# Altium schematic sheet RS232_RS485_INTERFACE.SchDoc
size A4; SheetNumber: 18; SheetTotal: 27
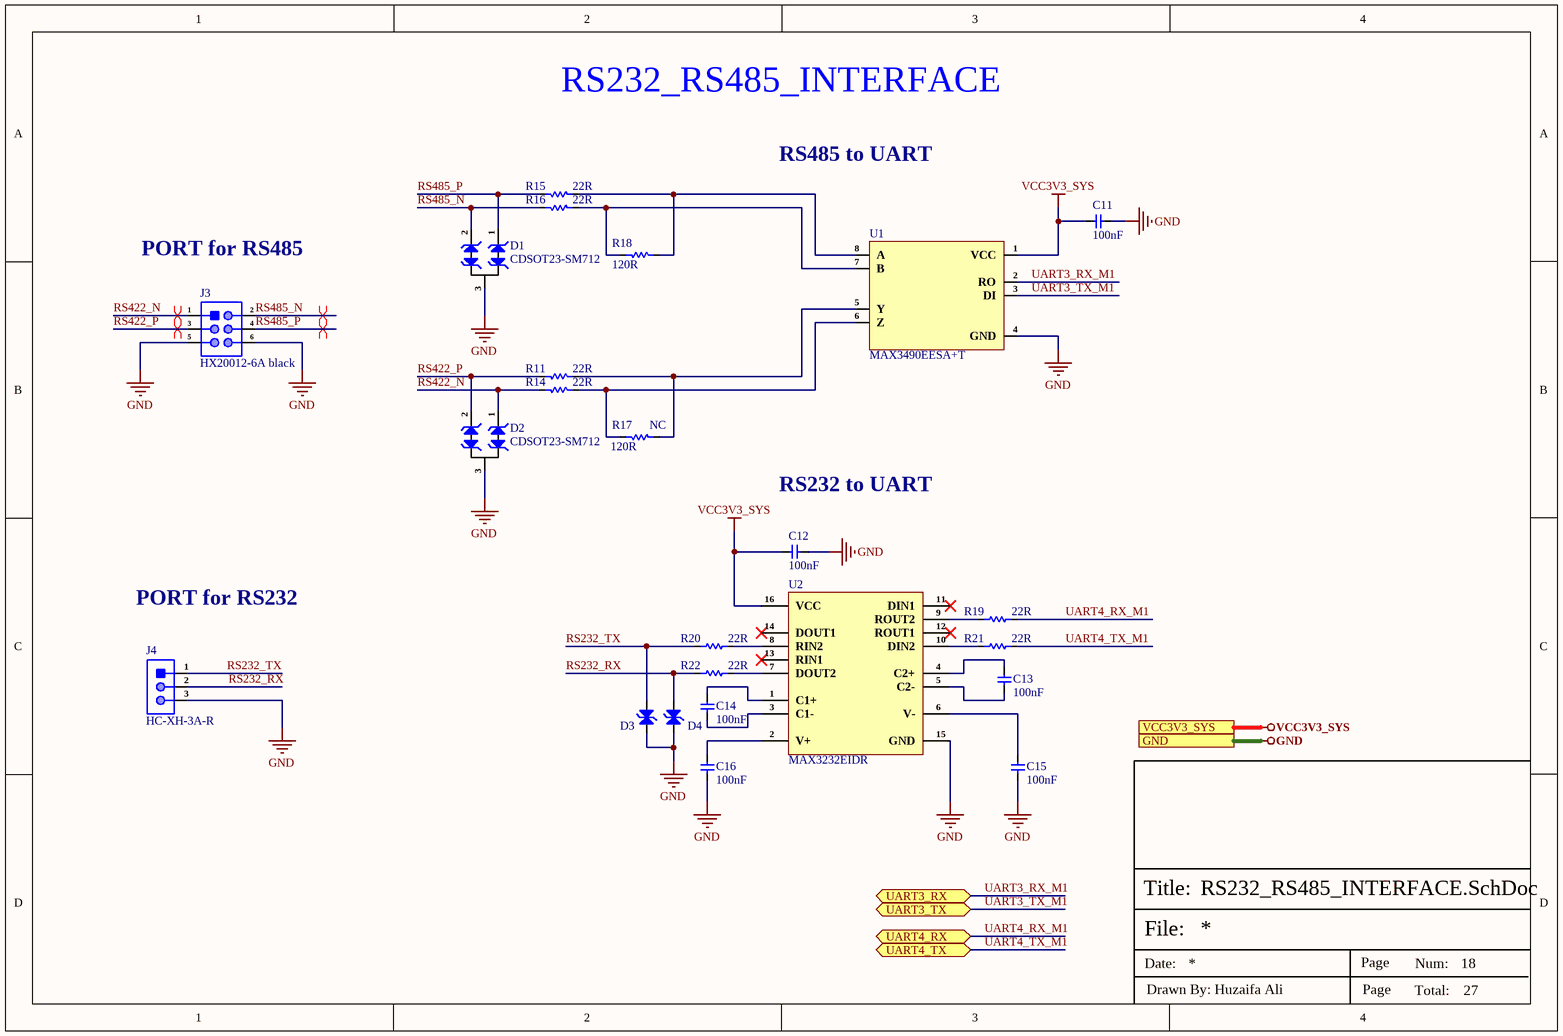
[diagram p0: RS232_RS485_INTERFACE.SchDoc]

## Parts
C11  100nF  [Cap-0402]
C12  100nF  [Cap-0402]
C13  100nF  [Cap-0402]
C14  100nF  [Cap-0402]
C15  100nF  [Cap-0402]
C16  100nF  [Cap-0402]
D1  CDSOT23-SM712  [SOT-23]
D2  CDSOT23-SM712  [SOT-23]
D3  ESD5451N  [DFN1006-2L (Bi-Directional)]  (value not drawn)
D4  ESD5451N  [DFN1006-2L (Bi-Directional)]  (value not drawn)
J3  HX20012-6A black  [HX20012-6A black]
J4  HC-XH-3A-R  [HC-XH-3A-R]
R11  22R  [Res-0402]
R14  22R  [Res-0402]
R15  22R  [Res-0402]
R16  22R  [Res-0402]
R17  NC  [Res-0603]
R18  120R  [Res-0603]
R19  22R  [Res-0402]
R20  22R  [Res-0402]
R21  22R  [Res-0402]
R22  22R  [Res-0402]
U1  MAX3490EESA+T  [SOIC-8(0.154", 3.90mm Width)]
U2  MAX3232EIDR  [SOIC-16]

## Ports
GND (see TOP SHEET[1D], AUDIO_INTERFACE[1D], BUCK REGULATOR[3D], DEBUG_UART_INTERFACE[3D], DIGITAL IO_RELAY_SHEET[5D], DUAL_SIM_INTERFACE[3D], ETHERNET_PHY0[4D], ETHERNET_PHY1[4D], GSM_INTERFACE[2D], HDMI_INTERFACE[3D], INPUT_PROTECTION[3D], LINEAR_VOLTAGE_REG[3D], MICRO_SD_INTERFACE[3D], MIPI-DSI DISPLAY[3D], POWER SECTION[3D], PUSH BUTTONs_INTERFACE[3C], RGB_LEDs_INTERFACE[3D], ROCKCHIP_PWR_SUPPLY[1D], ROCKCHIP_SYSTEM_CONTROL[3C], SENSOR_SHEET[3D], USB2.0_INTERFACE[3D], USB3.0_INTERFACE[3D], USB-C_INTERFACE[2D], WIEGAND_INTERFACE[3D], WIFI_BLUETOOTH_SHEET[4C]), UART3_RX (bidir, see TOP SHEET[2D], DEBUG_UART_INTERFACE[3D]), UART3_TX (bidir, see TOP SHEET[2D], DEBUG_UART_INTERFACE[3D]), UART4_RX (bidir, see TOP SHEET[2D], DEBUG_UART_INTERFACE[3D]), UART4_TX (bidir, see TOP SHEET[2D], DEBUG_UART_INTERFACE[3D]), VCC3V3_SYS (see TOP SHEET[1D], AUDIO_INTERFACE[1D], BUCK REGULATOR[3D], DEBUG_UART_INTERFACE[3D], DIGITAL IO_RELAY_SHEET[5D], ETHERNET_PHY0[4D], ETHERNET_PHY1[4D], GSM_INTERFACE[2D], HDMI_INTERFACE[3D], LINEAR_VOLTAGE_REG[3D], MIPI-DSI DISPLAY[3D], POWER SECTION[3D], PUSH BUTTONs_INTERFACE[3C], ROCKCHIP_PWR_SUPPLY[1D], ROCKCHIP_SYSTEM_CONTROL[3C], SENSOR_SHEET[3D], USB-C_INTERFACE[2D], WIEGAND_INTERFACE[3D], WIFI_BLUETOOTH_SHEET[4C])

## Nets
GND: C11.2 C12.2 C15.2 C16.2 D1.3(GND) D2.3(GND) D3.1(K) D4.1(K) J3.5 J3.6 J4.3 U1.4(GND) U2.15(GND) ; port GND
VCC3V3_SYS: C11.1 C12.1 U1.1(VCC) U2.16(VCC) ; port VCC3V3_SYS
RS232_RX: D4.2(K) J4.2 R22.1
RS232_TX: D3.2(K) J4.1 R20.1
RS422_N: D2.1(IO1) J3.1 R14.2
RS422_P: D2.2(IO2) J3.3 R11.2
RS485_N: D1.2(IO2) J3.2 R16.2
RS485_P: D1.1(IO1) J3.4 R15.2
UART3_RX_M1: U1.2(RO) ; port UART3_RX
UART3_TX_M1: U1.3(DI) ; port UART3_TX
UART4_RX_M1: R19.2 ; port UART4_RX
UART4_TX_M1: R21.2 ; port UART4_TX
NetC13_1: C13.1 U2.4(C2+)
NetC13_2: C13.2 U2.5(C2-)
NetC14_1: C14.1 U2.1(C1+)
NetC14_2: C14.2 U2.3(C1-)
NetC15_1: C15.1 U2.6(V-)
NetC16_1: C16.1 U2.2(V+)
NetR11_1: R11.1 R17.1 U1.5(Y)
NetR14_1: R14.1 R17.2 U1.6(Z)
NetR15_1: R15.1 R18.1 U1.8(A)
NetR16_1: R16.1 R18.2 U1.7(B)
NetR19_1: R19.1 U2.9(ROUT2)
NetR20_2: R20.2 U2.8(RIN2)
NetR21_1: R21.1 U2.10(DIN2)
NetR22_2: R22.2 U2.7(DOUT2)

Not connected (* = marked no-connect by the designer): U2 11(DIN1)* 12(ROUT1)* 13(RIN1)* 14(DOUT1)*

## Layout directives
differential pair; net class RS485; differential pair class DIFF_RS485_120; rule Impedance Constraint [Min = 115.0    Max = 120.0    ]; rule Matched Net Lengths [Tolerance = 0.508mm]: RS422_N, RS422_P, RS485_N, RS485_P

## Notes on the sheet
- RS232_RS485_INTERFACE
- RS485 to UART
- PORT for RS485
- (near R17) 120R
- RS232 to UART
- PORT for RS232
- File:
- Title:
- Date:
- Page
- Num:
- Total:
- Drawn By: Huzaifa Ali

## Library data of the parts
C11-C16 = CC0402KRX5R7BB104: CAP CER 0.1UF 16V X5R 0402; Manufacturer: Yageo; Tolerance: 10%; Supplier 1: Mouser; Manufacturer Part Number: CC0402KRX5R7BB104; RoHS: Yes; Category: Ceramic Capacitors; Stock 1: 936792; Pricing 1: 1=0.10000, 10=0.02300, 50=0.02300, 100=0.01100, 1000=0.00600, 10000=0.00400 (USD); Mount: Surface Mount; Case/Package: 0402; Case Code (Metric): 1005; Case Code (Imperial): 0402; Min Operating Temperature: -55°C; Max Operating Temperature: 85°C; Capacitance: 100nF; Packaging: Tape and Reel; Voltage Rating: 16V; Dielectric: X5R; Termination: SMD/SMT; Voltage Rating (DC): 16V; Package Quantity: 1; Series: CC; Length: 1mm; Width: 0.02inch; Height: 0.5mm; Thickness: 0.022inch; Lead Free: Lead Free; RoHS Compliant: Yes; ComponentLink1URL: https://datasheet.ciiva.com/155/mlccorderingcode-155879.pdf?src-supplier=Digi-Key; ComponentLink1Description: https://datasheet.ciiva.com/155/mlccorderingcode-155879.pdf?src-supplier=Digi-Key; ComponentLink2URL: https://datasheet.ciiva.com/155/mlccorderingcode-155878.pdf?src-supplier=Digi-Key; ComponentLink2Description: https://datasheet.ciiva.com/155/mlccorderingcode-155878.pdf?src-supplier=Digi-Key; ComponentLink3URL: https://datasheet.ciiva.com/155/mlccorderingcode-155880.pdf?src-supplier=Digi-Key; ComponentLink3Description: https://datasheet.ciiva.com/155/mlccorderingcode-155880.pdf?src-supplier=Digi-Key; ComponentLink4URL: https://datasheet.ciiva.com/11464/upy-gphc-x5r-4v-to-50v-12-11464869.pdf?src-supplier=Avnet; ComponentLink4Description: https://datasheet.ciiva.com/11464/upy-gphc-x5r-4v-to-50v-12-11464869.pdf?src-supplier=Avnet; Supplier Part Number 1: 603-CC402KRX5R7BB104; LCSC Part Number: C106204; Number of Pins: 2; Resistor Type: Ceramic; Construction: Flat; Depth: 0.5mm; Radiation Hardening: No; REACH SVHC: Unknown; Halogen Free: Halogen Free
D1 D2 = CDSOT23-SM712: TVS DIODE 7V/12V 14V/26V SOT23-3; Manufacturer: Bourns; Direction: Bidirectional; Value: 75pF; Max Surge Current: 30A; Polarity: Bidirectional,Unidirectional; Number of Channels: 2; Breakdown Voltage: 13.3V; Clamping Voltage: 19V; Working Voltage: 12V; Min Breakdown Voltage: 7.5V; Power Line Protection: No; Leakage Current: 20uA; Peak Pulse Current: 17A; Diode Type: ZENER; Max Power Dissipation: 600W; Peak Pulse Power: 400W; ESD Protection: Yes; Test Current: 1mA; Item Type: Surge Protection (TVS/ESD); Supplier: Rs; Supplier Part Number: 7673728P; Manufacturer Part Number: CDSOT23-SM712; RoHS: Yes; Category: TVS Diodes; Stock: 89660; Pricing: 100=0.935, 1500=0.651, 3000=0.565, 6000=0.553 (GBP); Mounting Technology: Surface Mount; Case/Package: SOT-23; Pins: 3; Contact Plating: Tin; Min Operating Temperature: -55°C; Max Operating Temperature: 150°C; Packaging: Tape and Reel; Series: -; Termination: SMD/SMT; Reverse Standoff Voltage: 12V; Number of Elements: 2; Reverse Breakdown Voltage: 13.3V; Number of Bidirectional Channels: 2; Power Dissipation: 400W; Max Reverse Leakage Current: 20uA; Max Breakdown Voltage: 13.3V; Length: 3.04mm; Width: 0.055inch; Height: 1.11mm; Depth: 1.4mm; Radiation Hardening: No; Reach SVHC Compliant: No; RoHS Compliant: Yes; ComponentLink1URL: https://datasheet.ciiva.com/1281/1670933-1281331.pdf?src-supplier=Farnell; ComponentLink1Description: https://datasheet.ciiva.com/1281/1670933-1281331.pdf?src-supplier=Farnell; ComponentLink2URL: https://datasheet.ciiva.com/4510/cdsot23-sm712-25932-4510261.pdf?src-supplier=Mouser; ComponentLink2Description: https://datasheet.ciiva.com/4510/cdsot23-sm712-25932-4510261.pdf?src-supplier=Mouser; ComponentLink3URL: https://datasheet.ciiva.com/11193/cdsot23-sm712-11193846.pdf?src-supplier=Avnet; ComponentLink3Description: https://datasheet.ciiva.com/11193/cdsot23-sm712-11193846.pdf?src-supplier=Avnet; ComponentLink4URL: https://datasheet.ciiva.com/22696/1670933-22696779.pdf?src-supplier=Element14; ComponentLink4Description: https://datasheet.ciiva.com/22696/1670933-22696779.pdf?src-supplier=Element14; ComponentLink5URL: https://datasheet.ciiva.com/26828/getdatasheetpartid-418501-26828522.pdf?src-supplier=Verical; ComponentLink5Description: https://datasheet.ciiva.com/26828/getdatasheetpartid-418501-26828522.pdf?src-supplier=Verical; ComponentLink6URL: https://datasheet.ciiva.com/337/cdsot23-sm712-337451.pdf?src-supplier=Digikey; ComponentLink6Description: https://datasheet.ciiva.com/337/cdsot23-sm712-337451.pdf?src-supplier=Digikey; ComponentLink7URL: https://datasheet.ciiva.com/337/cdsot23-sm712-337452.pdf?src-supplier=Digikey; ComponentLink7Description: https://datasheet.ciiva.com/337/cdsot23-sm712-337452.pdf?src-supplier=Digikey; LCSC Part Number: C404012
D3 D4 = ESD5451N: DFN1006-2(0402) ESD Protection Devices ROHS; Manufacturer: TECH PUBLIC; Manufacturer Part Number: ESD5451N; Footprint: DFN1006-2(0402); ComponentLink1Description: LCSC; ComponentLink1URL: https://www.lcsc.com/product-detail/span-style-background-color-ff0-ESD-span-Protection-Devices_TECH-PUBLIC-ESD5451N_C2936977.html; LCSC Part Number: C2936977
J3 = HX20012-6A black: 2x3P 2 2mm 2mm male 3 -25℃~+85℃ 3A Straight Plugin,P=2mm Wire To Board / Wire To Wire Connector ROHS; Manufacturer: HX(Zhejiang Yueqing Hongxing Elec); Manufacturer Part Number: HX20012-6A black; Package: Plugin,P=2mm; LCSC Part Number: C469723; Item Type: Wire To Wire Connector; ComponentLink1Description: LCSC; ComponentLink1URL: https://jlcpcb.com/partdetail/475972-HX20012_6Ablack/C469723
J4 = HC-XH-3A-R: 1x3P 3P XH 1 Tin 2.5mm 3 -25℃~+85℃ Brass 3A Straight Plugin,P=2.5mm Wire To Board Connector ROHS; Manufacturer: HCTL; Manufacturer Part Number: HC-XH-3A-R; Package: Plugin,P=2.5mm; LCSC Part Number: C7466690; Item Type: Wire To Board Connector; ComponentLink1Description: LCSC; ComponentLink1URL: https://www.lcsc.com/product-detail/Wire-To-Board-Connector_HCTL-HC-XH-3A-R_C7466690.html
R11 R14-R16 R19-R22 = RC0402FR-0722RL: RES 22 OHM 1% 1/16W 0402; Manufacturer: Yageo; Max Power Dissipation: 63mW; Temperature Coefficient: 100ppm/°C; Voltage Rating: 50V; Power Rating: 62.5mW; Item Type: Resistor; Supplier 1: Avnet; Manufacturer Part Number: RC0402FR-0722RL; Stock 1: 1810000; Pricing 1: 10000=0.00085 (USD); Case/Package: 0402; Case Code (Metric): 1005; Case Code (Imperial): 0402; Min Operating Temperature: -55°C; Max Operating Temperature: 155°C; Packaging: Tape and Reel; Resistance: 22R; Resistor Type: Thick Film; Number of Terminations: 2; Tolerance: 1%; Features: Moisture Resistant; Length: 1mm; Width: 0.5mm; Height: 0.32mm; RoHS Compliant: Yes; ComponentLink1URL: https://datasheet.ciiva.com/11819/0900766b80c66297-11819462.pdf?src-supplier=RSComponents; ComponentLink1Description: https://datasheet.ciiva.com/11819/0900766b80c66297-11819462.pdf?src-supplier=RSComponents; Supplier Part Number 1: RC0402FR-0722RL; LCSC Part Number: C114765; RoHS: Yes; Category: Chip SMD Resistors; Number of Pins: 2; Size Code: 0402; Voltage Rating (DC): 50V; Termination: SMD/SMT; Series: RC; Resistance Tolerance: 1%; Technology: THICK FILM; Construction: Rectangular; Depth: 0.5mm; Reach SVHC Compliant: Yes; Military Standard: Not; Lead Free: Lead Free; ComponentLink2URL: https://datasheet.ciiva.com/7849/1018594-7849912.pdf?src-supplier=Element14; ComponentLink2Description: https://datasheet.ciiva.com/7849/1018594-7849912.pdf?src-supplier=Element14; ComponentLink3URL: https://datasheet.ciiva.com/7849/1018594-7849911.pdf?src-supplier=Element14; ComponentLink3Description: https://datasheet.ciiva.com/7849/1018594-7849911.pdf?src-supplier=Element14; ComponentLink4URL: https://datasheet.ciiva.com/16930/pyu-rc0402-51-rohs-l-6-r-16930687.pdf?src-supplier=Future+Electronics; ComponentLink4Description: https://datasheet.ciiva.com/16930/pyu-rc0402-51-rohs-l-6-r-16930687.pdf?src-supplier=Future+Electronics; ComponentLink5URL: https://datasheet.ciiva.com/26829/getdatasheetpartid-554995-26829991.pdf?src-supplier=Verical; ComponentLink5Description: https://datasheet.ciiva.com/26829/getdatasheetpartid-554995-26829991.pdf?src-supplier=Verical
R17 = RT0603BRB07120RL: RES SMD 120 OHM 0.1% 1/10W 0603; Manufacturer: Yageo; Temperature Coefficient: 10ppm/°C; Voltage Rating: 75V; Max Power Dissipation: 100mW; Value: 120R; Item Type: Resistor; Manufacturer Part Number: RT0603BRB07120RL; RoHS: Yes; Category: Chip SMD Resistors; Case/Package: 0603; Min Operating Temperature: -55°C; Max Operating Temperature: 155°C; Tolerance: 0.1%; Packaging: Tape and Reel; Number of Terminations: 2; Features: Moisture Resistant; Series: RT; Length: 0.063inch; Width: 0.031inch; Height: 0.022inch; RoHS Compliant: Yes; ComponentLink1URL: http://www.yageo.com/documents/recent/PYu-RT_1-to-0.01_RoHS_L_8.pdf?src-supplier=Digikey; ComponentLink1Description: http://www.yageo.com/documents/recent/PYu-RT_1-to-0.01_RoHS_L_8.pdf?src-supplier=Digikey; LCSC Part Number: C860088; Supplier: Digikey; Supplier Part Number: RT0603BRB07120RL-ND; Pricing: 5000=0.13797 (USD)
R18 = RT0603BRB07120RL: RES SMD 120 OHM 0.1% 1/10W 0603; Manufacturer: Yageo; Temperature Coefficient: 10ppm/°C; Voltage Rating: 75V; Max Power Dissipation: 100mW; Item Type: Resistor; Manufacturer Part Number: RT0603BRB07120RL; RoHS: Yes; Category: Chip SMD Resistors; Case/Package: 0603; Min Operating Temperature: -55°C; Max Operating Temperature: 155°C; Tolerance: 0.1%; Packaging: Tape and Reel; Number of Terminations: 2; Features: Moisture Resistant; Series: RT; Length: 0.063inch; Width: 0.031inch; Height: 0.022inch; RoHS Compliant: Yes; ComponentLink1URL: http://www.yageo.com/documents/recent/PYu-RT_1-to-0.01_RoHS_L_8.pdf?src-supplier=Digikey; ComponentLink1Description: http://www.yageo.com/documents/recent/PYu-RT_1-to-0.01_RoHS_L_8.pdf?src-supplier=Digikey; LCSC Part Number: C860088; Supplier: Digikey; Supplier Part Number: RT0603BRB07120RL-ND; Pricing: 5000=0.13797 (USD); Value: 120R
U1 = MAX3490EESA+T: IC TXRX RS485/422 10MBPS 8SOIC; Manufacturer: Maxim; Supplier: Mouser; Supplier Part Number: 700-MAX3490EESAT; Manufacturer Part Number: MAX3490EESA+T; RoHS: Yes; Item Type: IC; Stock: 5952; Pricing: 1=5.92, 10=5.35, 50=5.1, 100=4.43, 1000=4.38, 10000=4.34 (USD); ComponentLink1URL: https://datasheet.ciiva.com/3029/max3483e-max3491e-3029646.pdf?src-supplier=Avnet; ComponentLink1Description: https://datasheet.ciiva.com/3029/max3483e-max3491e-3029646.pdf?src-supplier=Avnet; ComponentLink2URL: https://datasheet.ciiva.com/1775/max3483-max3491-1775008.pdf?src-supplier=Digikey; ComponentLink2Description: https://datasheet.ciiva.com/1775/max3483-max3491-1775008.pdf?src-supplier=Digikey; LCSC Part Number: C5342105
U2 = MAX3232EIDR: IC RS232 LINE DVR/RCVR 16-SOIC; Manufacturer: Texas Instruments; Number of Transmitters: 2; Data Rate: 250Kbps; Operating Supply Voltage: 5V; Logic Function: Transceiver,Receiver; Number of Transceivers: 1; Supply Current: 1mA; Max Supply Voltage: 5.5V; Min Supply Voltage: 3V; Simplex/Duplex: Full Duplex; Propagation Delay: 0.3us; Supplier 1: Mouser; Manufacturer Part Number: MAX3232EIDR; RoHS: Yes; Category: Interface ICs; Stock 1: 49030; Pricing 1: 1=1.79, 10=1.56, 50=1.56, 100=1.44, 1000=1.44, 10000=1.41 (USD); Mount: Surface Mount; Case/Package: D; Number of Pins: 16; Weight: 0.014829oz; Min Operating Temperature: -40°C; Max Operating Temperature: 85°C; Package Quantity: 1; Packaging: Tape and Reel; Number of Receivers: 2; Number of Drivers: 2; Series: -; Operating Supply Current: 1mA; Radiation Hardening: No; Lead Free: Lead Free; RoHS Compliant: Yes; Reach SVHC Compliant: No; ComponentLink1URL: https://datasheet.ciiva.com/46394/1863621-46394524.pdf?src-supplier=Element14; ComponentLink1Description: https://datasheet.ciiva.com/46394/1863621-46394524.pdf?src-supplier=Element14; ComponentLink2URL: https://datasheet.ciiva.com/46398/1863621-46398054.pdf?src-supplier=Element14; ComponentLink2Description: https://datasheet.ciiva.com/46398/1863621-46398054.pdf?src-supplier=Element14; ComponentLink3URL: https://datasheet.ciiva.com/1703/max3232e-1703394.pdf?src-supplier=Digikey; ComponentLink3Description: https://datasheet.ciiva.com/1703/max3232e-1703394.pdf?src-supplier=Digikey; ComponentLink4URL: https://datasheet.ciiva.com/1703/max3232e-1703393.pdf?src-supplier=Digikey; ComponentLink4Description: https://datasheet.ciiva.com/1703/max3232e-1703393.pdf?src-supplier=Digikey; ComponentLink5URL: https://datasheet.ciiva.com/1703/max3232e-1703395.pdf?src-supplier=Digikey; ComponentLink5Description: https://datasheet.ciiva.com/1703/max3232e-1703395.pdf?src-supplier=Digikey; ComponentLink6URL: https://datasheet.ciiva.com/15151/getdatasheetpartid-49711-15151143.pdf?src-supplier=Verical; ComponentLink6Description: https://datasheet.ciiva.com/15151/getdatasheetpartid-49711-15151143.pdf?src-supplier=Verical; Supplier Part Number 1: 595-MAX3232EIDR; Item Type: IC